# EAGLE design gcplus2.0 (EAGLE 9.4.0)
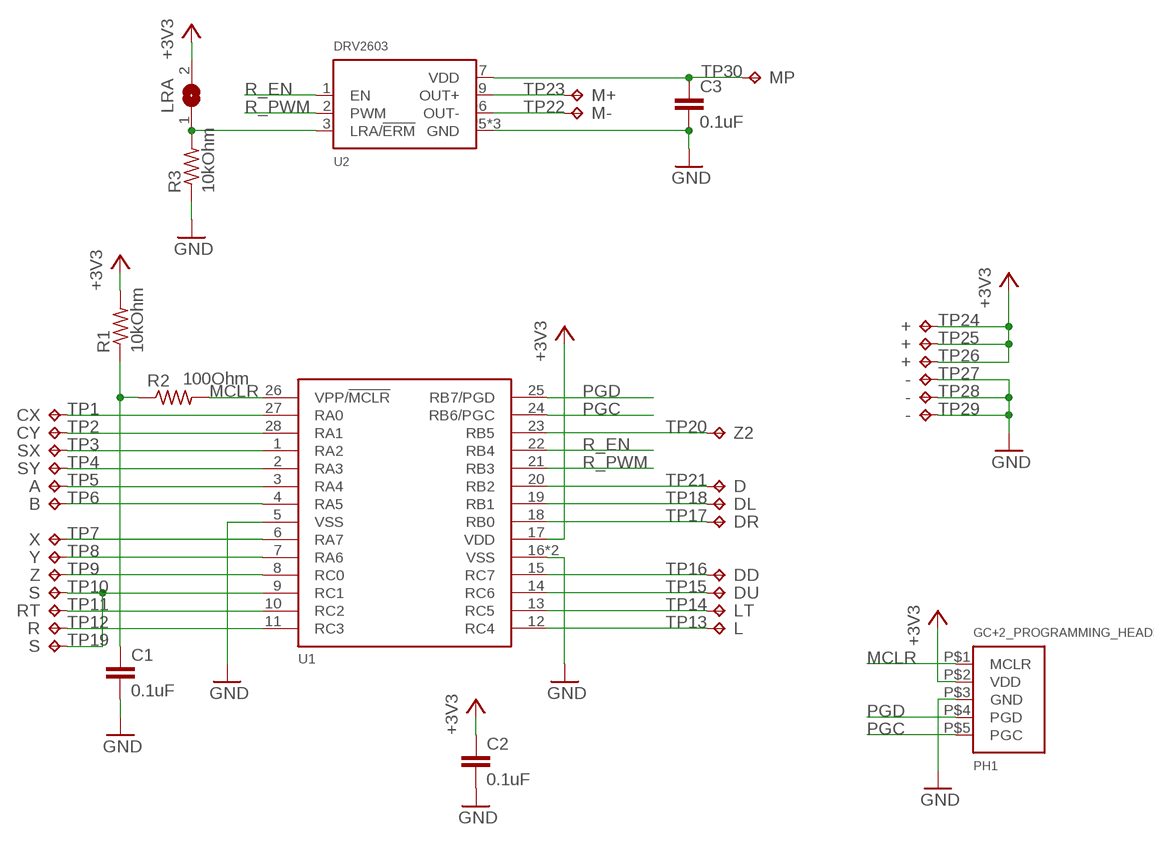
[diagram p0: schematic, sheet 1]

## Parts
C1  0.1uF  C-EUC0402  [C0402]
C2  0.1uF  C-EUC0402  [C0402]
C3  0.1uF  C-EUC0402  [C0402]
LRA  SJ  [SJ]
PH1  GC+2_PROGRAMMING_HEADER  [GC+2_PROGRAMMING_HEADER]
R1  10kOhm  R-US_R0402  [R0402]
R2  100Ohm  R-US_R0402  [R0402]
R3  10kOhm  R-US_R0402  [R0402]
TP1  TPTP10SQ  [TP10SQ]
TP2  TPTP10SQ  [TP10SQ]
TP3  TPTP10SQ  [TP10SQ]
TP4  TPTP10SQ  [TP10SQ]
TP5  TPTP10SQ  [TP10SQ]
TP6  TPTP10SQ  [TP10SQ]
TP7  TPTP10SQ  [TP10SQ]
TP8  TPTP10SQ  [TP10SQ]
TP9  TPTP10SQ  [TP10SQ]
TP10  TPTP10SQ  [TP10SQ]
TP11  TPTP10SQ  [TP10SQ]
TP12  TPTP10SQ  [TP10SQ]
TP13  TPTP10SQ  [TP10SQ]
TP14  TPTP10SQ  [TP10SQ]
TP15  TPTP10SQ  [TP10SQ]
TP16  TPTP10SQ  [TP10SQ]
TP17  TPTP10SQ  [TP10SQ]
TP18  TPTP10SQ  [TP10SQ]
TP19  TPTP10SQ  [TP10SQ]
TP20  TPTP10SQ  [TP10SQ]
TP21  TPTP10SQ  [TP10SQ]
TP22  TPTP10SQ  [TP10SQ]
TP23  TPTP10SQ  [TP10SQ]
TP24  TPTP10SQ  [TP10SQ]
TP25  TPTP10SQ  [TP10SQ]
TP26  TPTP10SQ  [TP10SQ]
TP27  TPTP10SQ  [TP10SQ]
TP28  TPTP10SQ  [TP10SQ]
TP29  TPTP10SQ  [TP10SQ]
TP30  TPTP10SQ  [TP10SQ]
U1  PIC18F25K42  [QFN-28]
U2  DRV2603  [WQFN-10]

## Nets
+3V3: C2.1 LRA.2 PH1.P$2(VDD) R1.2 TP24.TP TP25.TP TP26.TP U1.17(VDD)
GND: C1.2 C2.2 C3.2 PH1.P$3(GND) R3.1 TP27.TP TP28.TP TP29.TP U1.5(VSS) U1.16(VSS) U1.PAD(VSS) U2.5(GND) U2.8(GND) U2.10(GND)
MCLR: PH1.P$1(MCLR) R2.2 U1.26(VPP/!MCLR)
MP: C3.1 TP30.TP U2.7(VDD)
N$1: TP1.TP U1.27(RA0)
N$2: TP2.TP U1.28(RA1)
N$3: TP3.TP U1.1(RA2)
N$4: TP4.TP U1.2(RA3)
N$5: TP5.TP U1.3(RA4)
N$6: TP6.TP U1.4(RA5)
N$7: TP7.TP U1.6(RA7)
N$8: TP8.TP U1.7(RA6)
N$9: TP9.TP U1.8(RC0)
N$10: LRA.1 R3.2 U2.3(LRA/!ERM)
N$11: TP10.TP TP19.TP U1.9(RC1)
N$12: TP11.TP U1.10(RC2)
N$13: TP12.TP U1.11(RC3)
N$14: TP14.TP U1.13(RC5)
N$15: TP15.TP U1.14(RC6)
N$16: TP16.TP U1.15(RC7)
N$17: TP17.TP U1.18(RB0)
N$18: TP18.TP U1.19(RB1)
N$19: TP21.TP U1.20(RB2)
N$20: TP23.TP U2.9(OUT+)
N$21: TP22.TP U2.6(OUT-)
N$22: TP20.TP U1.23(RB5)
N$25: C1.1 R1.1 R2.1
N$29: TP13.TP U1.12(RC4)
PGC: PH1.P$5(PGC) U1.24(RB6/PGC)
PGD: PH1.P$4(PGD) U1.25(RB7/PGD)
R_EN: U1.22(RB4) U2.1(EN)
R_PWM: U1.21(RB3) U2.2(PWM)

## Library data of the parts
C1-C3 = resistor:C-EU: CAPACITOR, European symbol
LRA = jumper:SJ: SMD solder JUMPER
PH1 = programmingheader:GC+2_PROGRAMMING_HEADER
R1-R3 = resistor:R-US_: RESISTOR, American symbol
TP1 = testpad:TP: Test pad; TP_SIGNAL_NAME: CX
TP2 = testpad:TP: Test pad; TP_SIGNAL_NAME: CY
TP3 = testpad:TP: Test pad; TP_SIGNAL_NAME: SX
TP4 = testpad:TP: Test pad; TP_SIGNAL_NAME: SY
TP5 = testpad:TP: Test pad; TP_SIGNAL_NAME: A
TP6 = testpad:TP: Test pad; TP_SIGNAL_NAME: B
TP7 = testpad:TP: Test pad; TP_SIGNAL_NAME: X
TP8 = testpad:TP: Test pad; TP_SIGNAL_NAME: Y
TP9 = testpad:TP: Test pad; TP_SIGNAL_NAME: Z
TP10 TP19 = testpad:TP: Test pad; TP_SIGNAL_NAME: S
TP11 = testpad:TP: Test pad; TP_SIGNAL_NAME: RT
TP12 = testpad:TP: Test pad; TP_SIGNAL_NAME: R
TP13 = testpad:TP: Test pad; TP_SIGNAL_NAME: L
TP14 = testpad:TP: Test pad; TP_SIGNAL_NAME: LT
TP15 = testpad:TP: Test pad; TP_SIGNAL_NAME: DU
TP16 = testpad:TP: Test pad; TP_SIGNAL_NAME: DD
TP17 = testpad:TP: Test pad; TP_SIGNAL_NAME: DR
TP18 = testpad:TP: Test pad; TP_SIGNAL_NAME: DL
TP20 = testpad:TP: Test pad; TP_SIGNAL_NAME: Z2
TP21 = testpad:TP: Test pad; TP_SIGNAL_NAME: D
TP22 = testpad:TP: Test pad; TP_SIGNAL_NAME: M-
TP23 = testpad:TP: Test pad; TP_SIGNAL_NAME: M+
TP24-TP26 = testpad:TP: Test pad; TP_SIGNAL_NAME: +
TP27-TP29 = testpad:TP: Test pad; TP_SIGNAL_NAME: -
TP30 = testpad:TP: Test pad; TP_SIGNAL_NAME: MP
U1 = PIC18F25K42:PIC18F25K42
U2 = drv2603:DRV2603

## Board
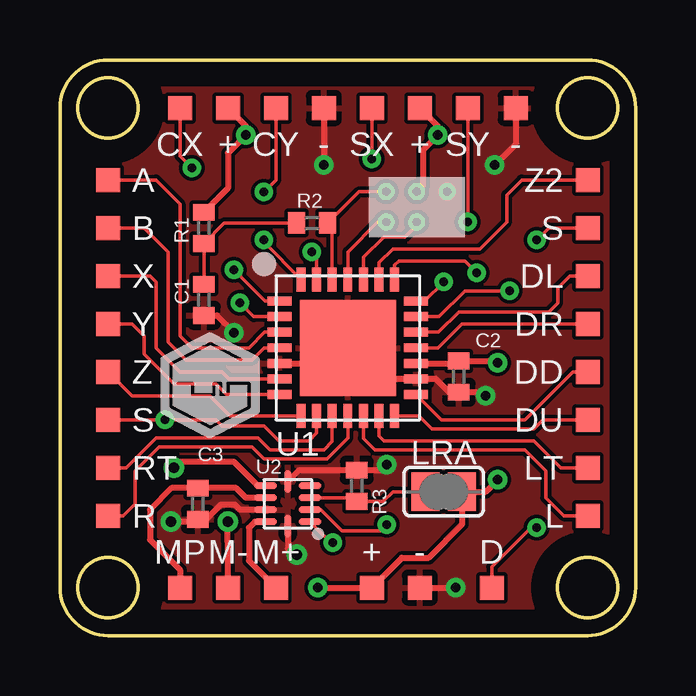
[diagram p1: board, top side]
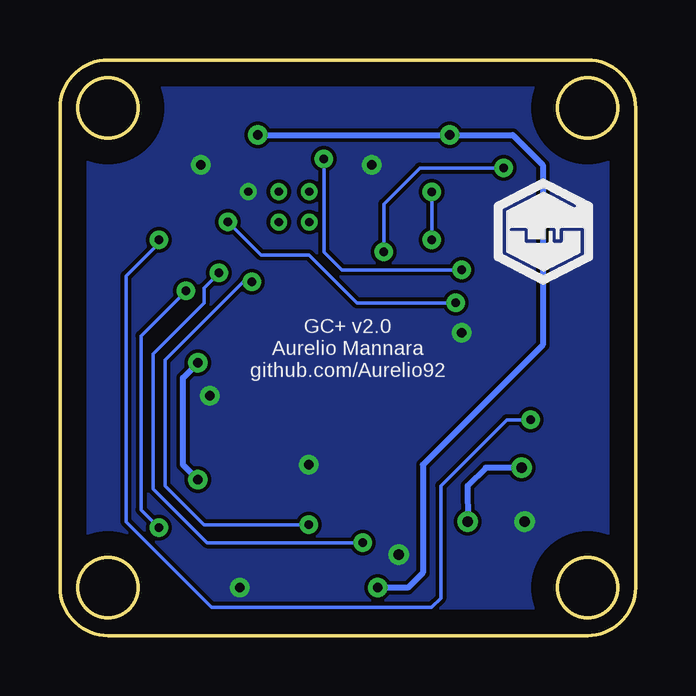
[diagram p2: board, bottom side, seen from below]

Size 24 x 24 mm. Coordinates in mm from the lower left corner, seen from the top.
Outline: 0,22 arc-90 2,24 22,24 arc-90 24,22 24,2 arc-90 22,0 2,0 arc-90 0,2 0,22
Outline: circle at 2,22 radius 1.25
Outline: circle at 22,22 radius 1.25
Outline: circle at 22,2 radius 1.25
Outline: circle at 2,2 radius 1.25
Copper layers (1*16): Top 0.035mm / dielectric 1.5mm / Bottom 0.035mm
Design rules "default *": minimum track width 6mil, minimum drill 0.35mm, track to track 6mil, track to pad 6mil, pad to pad 6mil, via to via 6mil, smd to smd 6mil, copper to edge 40mil, drill to drill 6mil, minimum pad ring 5mil, minimum via ring 8mil, stop-mask expansion 0mil, vias tented up to drill 100mil, thermal gap 10mil

### Footprints (pad centres in the part's own frame; a part is rotated, then mirrored left to right if it is on the bottom)
C0402 = smd 0.7 x 0.9: 1 -0.65,0; 2 0.65,0
SJ = smd 1.168 x 1.6: 1 -0.762,0; 2 0.762,0
GC+2_PROGRAMMING_HEADER = drill 0.35 pad 0.7: P$1 -1.27,0.635; P$2 0,0.635; P$3 1.27,0.635; P$4 -1.27,-0.635; P$5 0,-0.635
R0402 = smd 0.7 x 0.9: 1 -0.65,0; 2 0.65,0
TP10SQ = smd 1 x 1: TP 0,0
QFN-28 = smd 1 x 0.37: 1 -2.85,1.95; 2 -2.85,1.3; 3 -2.85,0.65; 4 -2.85,0; 5 -2.85,-0.65; 6 -2.85,-1.3; 7 -2.85,-1.95; 15 2.85,-1.95; 16 2.85,-1.3; 17 2.85,-0.65; 18 2.85,0; 19 2.85,0.65; 20 2.85,1.3; 21 2.85,1.95 | smd 0.37 x 1: 8 -1.95,-2.85; 9 -1.3,-2.85; 10 -0.65,-2.85; 11 0,-2.85; 12 0.65,-2.85; 13 1.3,-2.85; 14 1.95,-2.85; 22 1.95,2.85; 23 1.3,2.85; 24 0.65,2.85; 25 0,2.85; 26 -0.65,2.85; 27 -1.3,2.85; 28 -1.95,2.85 | smd 4 x 4: PAD 0,0
WQFN-10 = smd 0.28 x 0.95: 1 -0.75,-0.925; 2 -0.25,-0.925; 3 0.25,-0.925; 4 0.75,-0.925; 6 0.75,0.925; 7 0.25,0.925; 8 -0.25,0.925; 9 -0.75,0.925 | smd 0.95 x 0.28: 5 0.925,0; 10 -0.925,0

### Placement (x,y rotation side)
C1  6,14 270 top
C2  16.63,10.8 270 top
C3  5.75,5.5 270 top
LRA  16,6 0 top
PH1  14.88,17.88 0 top
R1  6,17 90 top
R2  10.51,17.2 0 top
R3  12.38,6.25 270 top
TP1  5,22 0 top
TP2  9,22 0 top
TP3  13,22 0 top
TP4  17,22 0 top
TP5  2,19 0 top
TP6  2,17 0 top
TP7  2,15 0 top
TP8  2,13 0 top
TP9  2,11 0 top
TP10  2,9 0 top
TP11  2,7 0 top
TP12  2,5 0 top
TP13  22,5 0 top
TP14  22,7 0 top
TP15  22,9 0 top
TP16  22,11 0 top
TP17  22,13 0 top
TP18  22,15 0 top
TP19  22,17 0 top
TP20  22,19 0 top
TP21  18,2 0 top
TP22  7,2 0 top
TP23  9,2 0 top
TP24  7,22 0 top
TP25  15,22 0 top
TP26  13,2 0 top
TP27  11,22 0 top
TP28  19,22 0 top
TP29  15,2 0 top
TP30  5,2 0 top
U1  12,12 0 top
U2  9.5,5.5 90 top

### Tracks (layer width: path | path; a pad name or v marks a point on that pad's centre or on a via)
+3V3  (via drill 0.4)
  Top 0.254: U1.17 16.53,11.35 C2.1 18.18,11.45 v18.25,11.38 | v18.25,6.5 17.75,6 LRA.2 16.76,4.64 15.38,3.25 14.25,3.25 TP26.TP v10.75,2 | TP24.TP 7.75,21.25 v7.75,20.88 7,20.12 7,18.65 R1.2 | TP25.TP 15.75,21.25 v15.75,20.88 15.12,20.25 15.12,18.76 PH1.P$2
  Bottom 0.254: v18.25,6.5 18.88,7.12 18.88,10.75 v18.25,11.38 | v10.75,2 9.5,2 8.88,2.62 8.88,7.12 3.88,12.12 3.88,19.62 5.12,20.88 v7.75,20.88 v15.75,20.88
GND  (via drill 0.4, 0.45)
  Top 0.254: U2.8 7.75,5.25 | U2.5 9.97,6.9 R3.1 13.41,6.9 v13.62,7.12 | v17.75,10 17.5,10 17.35,10.15 C2.2 16.23,10.15 15.68,10.7 U1.16 13.3,10.7 U1.PAD 11.35,11.35 U1.5 | C1.2 6.53,13.35 v7.25,12.63 | TP27.TP v11,19.62 | TP28.TP 19,20.5 v18.12,19.62 | TP29.TP v16.5,2 | U2.10 9.5,3.62 9.75,3.38 v9.88,3.38 | 7.75,5.25 | 7.75,5.25 | 7.75,5.25 7.5,5.25 7.29,5.46 6.71,5.46 6.1,4.85 C3.2 5.65,4.75 v4.62,4.75
  pour Bottom: 2,32 32,32 32,-8 -8,-8 -8,32
  pour Top (isolate 0.127): 2,32 32,32 32,-8 -8,-8 -8,32
MCLR
  Top 0.152: U1.26 11.35,17.01 R2.2 12.47,18.51 PH1.P$1
MP
  Top 0.254: U2.7 7.75,5.75 7.35,6.15 C3.1 4.65,6.15 3.75,5.25 3.75,4 5,2.75 TP30.TP
N$1  (via drill 0.35)
  Top 0.152: U1.27 10.7,15.8 v10.5,16 | v5.5,19.5 5,20 TP1.TP
  Bottom 0.152: v5.5,19.5 9,19.5 10.5,18 v10.5,16
N$2  (via drill 0.35)
  Top 0.152: U1.28 8.5,16.4 v8.5,16.5 | v8.5,18.5 9,19 TP2.TP
  Bottom 0.152: v8.5,16.5 v8.5,18.5
N$3  (via drill 0.35)
  Top 0.152: U1.1 8.55,13.95 v7.25,15.25 | v13,19.88 TP3.TP
  Bottom 0.152: v7.25,15.25 12.25,15.25 13,16 v13,19.88
N$4  (via drill 0.35)
  Top 0.152: U1.2 8.07,13.3 v7.5,13.88 | v17,17.25 TP4.TP
  Bottom 0.152: v7.5,13.88 11.62,13.88 13.62,15.88 15.62,15.88 v17,17.25
N$5
  Top 0.152: TP5.TP 4,19 5,18 5,12.5 5.5,12 7.88,12 8.53,12.65 U1.3
N$6
  Top 0.152: U1.4 8.5,12 8,11.5 5.25,11.5 4.5,12.25 4.5,16 3.5,17 TP6.TP
N$7
  Top 0.152: TP7.TP 3.75,15 4,14.75 4,12 5,11 6.75,11 7.05,10.7 U1.6
N$8
  Top 0.152: U1.7 6.95,10.05 6.5,10.5 4.75,10.5 3.5,11.75 3.5,12.5 3,13 TP8.TP
N$9
  Top 0.152: TP9.TP 3,10 6.25,10 7.1,9.15 U1.8
N$10
  Top 0.152: U2.3 12.22,5.75 R3.2 13.47,5.6 13.88,6 LRA.1
N$11  (via drill 0.35)
  Top 0.152: U1.9 10.7,8.45 10.38,8.12 9.12,8.12 8.5,8.75 6.75,8.75 6.5,9 v4.38,9 TP10.TP | v19.88,16.5 20.38,17 TP19.TP
  Bottom 0.152: v19.88,16.5 19.88,16.38 21.25,15 21.25,4.75 17.67,1.17 8.5,1.17 8.12,1.54 8.12,6.25 5.38,9 v4.38,9
N$12
  Top 0.152: TP11.TP 2.75,7 4,8.25 8.25,8.25 8.75,7.75 11,7.75 11.35,8.1 U1.10
N$13
  Top 0.152: TP12.TP 2.62,5 3.12,5.5 3.12,6.88 4.12,7.88 8,7.88 8.5,7.38 11.12,7.38 12,8.25 U1.11
N$14
  Top 0.152: U1.13 13.3,8.32 13.5,8.12 19.75,8.12 20.88,7 TP14.TP
N$15
  Top 0.152: U1.14 14.97,9.15 15.5,8.62 19.75,8.62 20.12,9 TP15.TP
N$16
  Top 0.152: U1.15 15.9,9 19.38,9 21.38,11 TP16.TP
N$17
  Top 0.152: U1.18 15.75,12 16.75,13 TP17.TP
N$18
  Top 0.152: U1.19 15.78,12.65 16.62,13.5 20.38,13.5 20.75,13.88 20.75,14.5 21.25,15 TP18.TP
N$19  (via drill 0.35)
  Top 0.152: U1.20 15.8,13.3 16.88,14.38 v18.75,14.38 | v19.88,4.5 19.62,4.5 18,2.88 TP21.TP
  Bottom 0.152: v18.75,14.38 20.62,12.5 20.62,5.25 v19.88,4.5
N$20
  Top 0.254: U2.9 8.12,4.75 7.88,4.5 7.88,3.12 TP23.TP
N$21  (via drill 0.45)
  Top 0.254: U2.6 8.25,6.25 7.25,7.25 5,7.25 v4.75,7 | TP22.TP 7,3 v7,4.75
  Bottom 0.254: v4.75,7 6.25,7 7,6.25 v7,4.75
N$22
  Top 0.152: U1.23 13.3,15.55 13.88,16.12 17.5,16.12 18.62,17.25 18.62,18.38 19.25,19 TP20.TP
N$25
  Top 0.152: R2.1 6.85,17.2 R1.1 C1.1
N$29
  Top 0.152: U1.12 12.65,8.22 13.12,7.75 19.38,7.75 20.25,6.88 20.25,5.75 21,5 TP13.TP
PGC
  Top 0.152: U1.24 12.65,15.78 13.5,16.62 14.38,16.62 14.88,17.12 PH1.P$5
PGD
  Top 0.152: U1.25 12,16 13.24,17.24 PH1.P$4
R_EN  (via drill 0.35)
  Top 0.152: U1.22 13.95,15.45 14.12,15.62 16.88,15.62 v17.38,15.12 | v11.38,3.88 11.3,3.88 U2.1
  Bottom 0.152: v17.38,15.12 18,14.5 18,13.88 20.12,11.75 20.12,6.12 17.88,3.88 v11.38,3.88
R_PWM  (via drill 0.35)
  Top 0.152: U1.21 15.2,13.95 v16,14.75 | U2.2 10.88,5.25 11.75,4.38 13.38,4.38 v13.62,4.62
  Bottom 0.152: v13.62,4.62 18,4.62 19.62,6.25 19.62,11.5 16.38,14.75 v16,14.75

### Text on the board
bPlace: GC+ v2.0 / Aurelio Mannara / github.com/Aurelio92